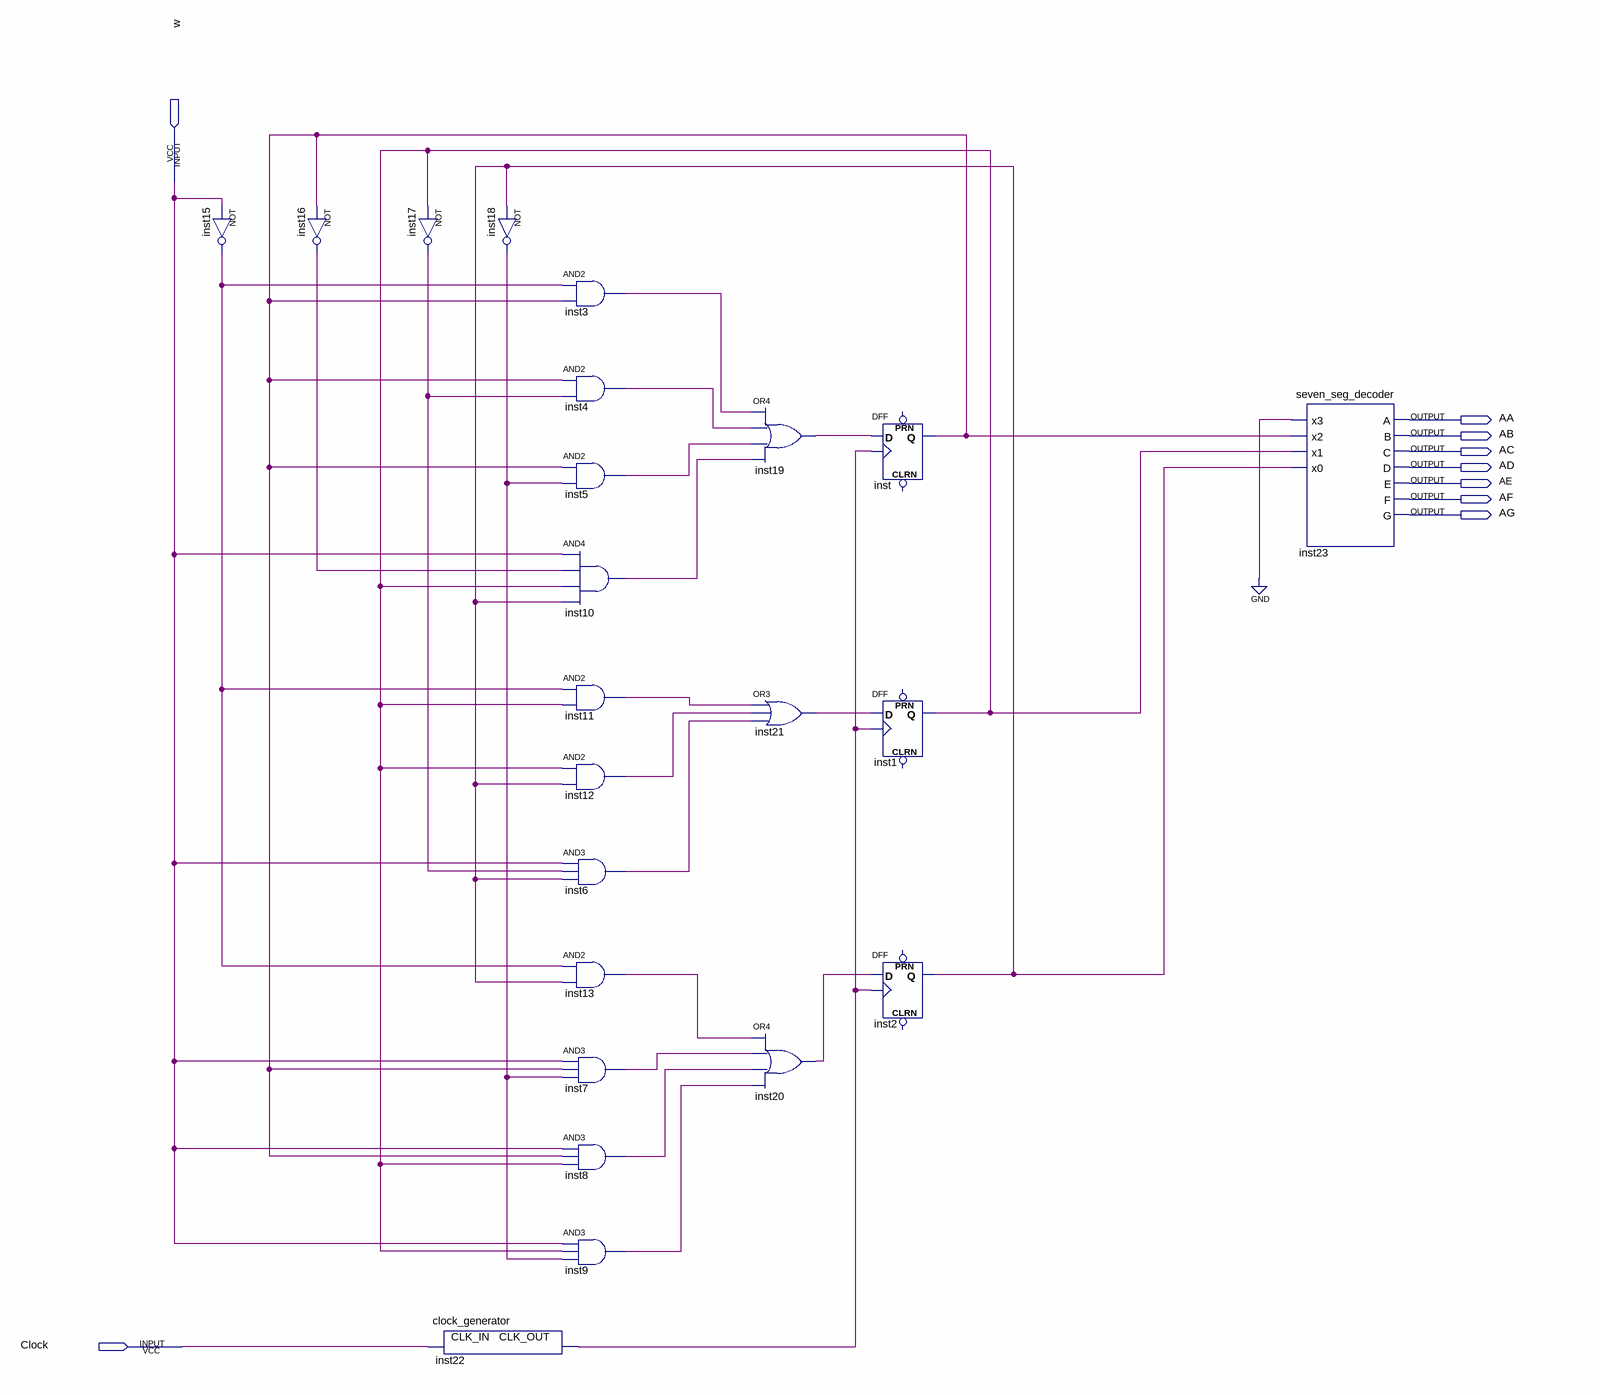
[diagram p0: schematic sheet]
// Quartus schematic Counter1.bdf as structural Verilog: 23 symbols, 9 pins
module Counter1 (
  input  w,
  input  Clock,
  output AA,
  output AB,
  output AC,
  output AD,
  output AE,
  output AF,
  output AG
);

  wire inst1_q, inst2_q, inst3_out, inst4_out, inst5_out, inst6_out, inst7_out, inst8_out, inst9_out,
       inst10_out, inst11_out, inst12_out, inst13_out, inst15_out, inst16_out, inst17_out, inst18_out,
       inst19_out, inst20_out, inst21_out, inst22_clk_out, inst_q;

  not inst15 (inst15_out, w);
  not inst16 (inst16_out, inst_q);
  not inst17 (inst17_out, inst1_q);
  clock_generator inst22 (.CLK_IN(Clock), .CLK_OUT(inst22_clk_out));
  not inst18 (inst18_out, inst2_q);
  and inst3 (inst3_out, inst15_out, inst_q);
  and inst4 (inst4_out, inst_q, inst17_out);
  and inst5 (inst5_out, inst_q, inst18_out);
  and inst10 (inst10_out, w, inst16_out, inst1_q, inst2_q);
  and inst11 (inst11_out, inst15_out, inst1_q);
  and inst12 (inst12_out, inst1_q, inst2_q);
  and inst6 (inst6_out, w, inst17_out, inst2_q);
  and inst13 (inst13_out, inst15_out, inst2_q);
  and inst7 (inst7_out, w, inst_q, inst18_out);
  and inst8 (inst8_out, w, inst_q, inst1_q);
  and inst9 (inst9_out, w, inst1_q, inst18_out);
  or inst19 (inst19_out, inst3_out, inst4_out, inst5_out, inst10_out);
  or inst21 (inst21_out, inst11_out, inst12_out, inst6_out);
  or inst20 (inst20_out, inst13_out, inst7_out, inst8_out, inst9_out);
  DFF inst (.CLK(inst22_clk_out), .D(inst19_out), .Q(inst_q));  // open: CLRN, PRN
  DFF inst1 (.CLK(inst22_clk_out), .D(inst21_out), .Q(inst1_q));  // open: CLRN, PRN
  DFF inst2 (.CLK(inst22_clk_out), .D(inst20_out), .Q(inst2_q));  // open: CLRN, PRN
  seven_seg_decoder inst23 (
    .x3(1'b0), .x2(inst_q), .x1(inst1_q), .x0(inst2_q), .A(AA), .B(AB), .C(AC), .D(AD), .E(AE), .F(AF), .G(AG));
endmodule
